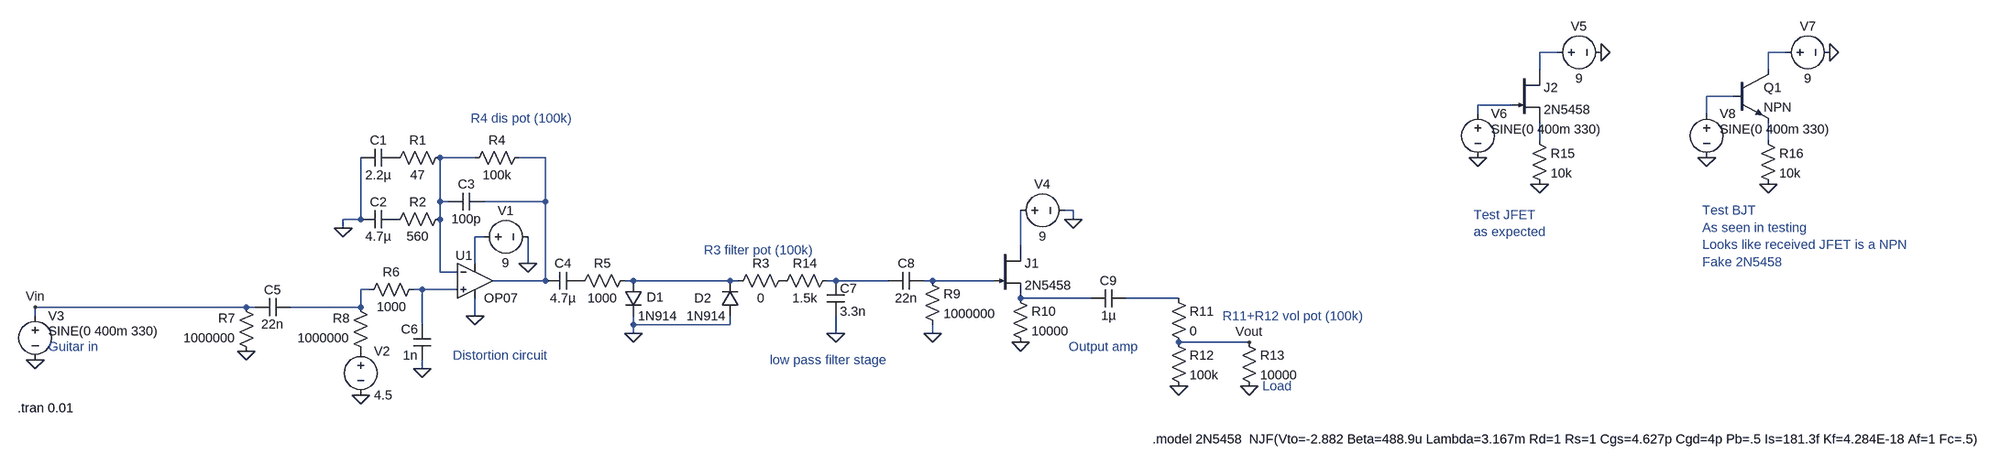
[diagram p0: schematic distortion sim.asc]
distortion sim.asc, the LTspice schematic file:
Version 4
SHEET 1 3272 680
WIRE 2352 -944 2320 -944
WIRE 2768 -944 2736 -944
WIRE 2320 -912 2320 -944
WIRE 2736 -912 2736 -944
WIRE 2672 -864 2624 -864
WIRE 2272 -848 2208 -848
WIRE 2208 -832 2208 -848
WIRE 2624 -832 2624 -864
WIRE 2320 -784 2320 -816
WIRE 2736 -784 2736 -816
WIRE 384 -752 320 -752
WIRE 512 -752 464 -752
WIRE 320 -672 320 -752
WIRE 336 -672 320 -672
WIRE 512 -672 512 -752
WIRE 512 -672 400 -672
WIRE 1472 -656 1456 -656
WIRE 176 -640 176 -752
WIRE 176 -640 144 -640
WIRE 320 -640 320 -672
WIRE 1472 -640 1472 -656
WIRE 144 -624 144 -640
WIRE 400 -608 384 -608
WIRE 1376 -592 1376 -656
WIRE 384 -560 384 -608
WIRE 480 -560 480 -608
WIRE 320 -544 320 -640
WIRE 352 -544 320 -544
WIRE 512 -528 512 -672
WIRE 512 -528 416 -528
WIRE 672 -528 656 -528
WIRE 848 -528 672 -528
WIRE 864 -528 848 -528
WIRE 1040 -528 1024 -528
WIRE 1136 -528 1040 -528
WIRE 1216 -528 1200 -528
WIRE 1328 -528 1216 -528
WIRE 192 -512 176 -512
WIRE 288 -512 272 -512
WIRE 352 -512 288 -512
WIRE 1504 -496 1376 -496
WIRE 1664 -496 1568 -496
WIRE -32 -480 -416 -480
WIRE -16 -480 -32 -480
WIRE 176 -480 176 -512
WIRE 176 -480 48 -480
WIRE -416 -464 -416 -480
WIRE 384 -464 384 -496
WIRE 288 -448 288 -512
WIRE 672 -448 672 -464
WIRE 848 -448 848 -464
WIRE 848 -448 672 -448
WIRE 672 -432 672 -448
WIRE 1040 -432 1040 -464
WIRE 1216 -432 1216 -448
WIRE 1792 -416 1664 -416
WIRE 288 -368 288 -384
FLAG 384 -464 0
FLAG 144 -624 0
FLAG 288 -368 0
FLAG -32 -400 0
FLAG 672 -432 0
FLAG 176 -320 0
FLAG -416 -384 0
FLAG 1040 -432 0
FLAG 1472 -640 0
FLAG 1376 -416 0
FLAG 1216 -432 0
FLAG 1664 -336 0
FLAG 1792 -336 0
FLAG -416 -480 Vin
FLAG 1792 -416 Vout
FLAG 480 -560 0
FLAG 2432 -944 0
FLAG 2320 -704 0
FLAG 2208 -752 0
FLAG 2848 -944 0
FLAG 2736 -704 0
FLAG 2624 -752 0
SYMBOL cap 240 -768 R90
WINDOW 0 0 32 VBottom 2
WINDOW 3 32 32 VTop 2
SYMATTR InstName C1
SYMATTR Value 2.2µ
SYMBOL cap 240 -656 R90
WINDOW 0 0 32 VBottom 2
WINDOW 3 32 32 VTop 2
SYMATTR InstName C2
SYMATTR Value 4.7µ
SYMBOL cap 400 -688 R90
WINDOW 0 0 32 VBottom 2
WINDOW 3 32 32 VTop 2
SYMATTR InstName C3
SYMATTR Value 100p
SYMBOL cap 576 -544 R90
WINDOW 0 0 32 VBottom 2
WINDOW 3 32 32 VTop 2
SYMATTR InstName C4
SYMATTR Value 4.7µ
SYMBOL res 336 -768 R90
WINDOW 0 0 56 VBottom 2
WINDOW 3 32 56 VTop 2
SYMATTR InstName R1
SYMATTR Value 47
SYMBOL res 336 -656 R90
WINDOW 0 0 56 VBottom 2
WINDOW 3 32 56 VTop 2
SYMATTR InstName R2
SYMATTR Value 560
SYMBOL res 480 -768 R90
WINDOW 0 0 56 VBottom 2
WINDOW 3 32 56 VTop 2
SYMATTR InstName R4
SYMATTR Value 100k
SYMBOL res 672 -544 R90
WINDOW 0 0 56 VBottom 2
WINDOW 3 32 56 VTop 2
SYMATTR InstName R5
SYMATTR Value 1000
SYMBOL res 288 -528 R90
WINDOW 0 0 56 VBottom 2
WINDOW 3 32 56 VTop 2
SYMATTR InstName R6
SYMATTR Value 1000
SYMBOL res -16 -384 R180
WINDOW 0 36 76 Left 2
WINDOW 3 36 40 Left 2
SYMATTR InstName R7
SYMATTR Value 1000000
SYMBOL res 192 -384 R180
WINDOW 0 36 76 Left 2
WINDOW 3 36 40 Left 2
SYMATTR InstName R8
SYMATTR Value 1000000
SYMBOL cap 48 -496 R90
WINDOW 0 0 32 VBottom 2
WINDOW 3 32 32 VTop 2
SYMATTR InstName C5
SYMATTR Value 22n
SYMBOL cap 304 -384 R180
WINDOW 0 24 56 Left 2
WINDOW 3 24 8 Left 2
SYMATTR InstName C6
SYMATTR Value 1n
SYMBOL Opamps\\OP07 384 -592 R0
WINDOW 0 -35 18 Left 2
SYMATTR InstName U1
SYMBOL diode 656 -528 R0
WINDOW 0 40 30 Left 2
SYMATTR InstName D1
SYMATTR Value 1N914
SYMBOL diode 864 -464 R180
WINDOW 0 50 32 Left 2
WINDOW 3 24 0 Left 2
SYMATTR InstName D2
SYMATTR Value 1N914
SYMBOL voltage 176 -416 R0
WINDOW 123 0 0 Left 0
WINDOW 39 0 0 Left 0
SYMATTR InstName V2
SYMATTR Value 4.5
SYMBOL voltage -416 -480 R0
WINDOW 3 24 44 Left 2
WINDOW 123 24 44 Left 2
WINDOW 39 0 0 Left 0
SYMATTR Value SINE(0 400m 330)
SYMATTR InstName V3
SYMBOL voltage 384 -608 R270
WINDOW 0 32 56 VTop 2
WINDOW 3 -32 56 VBottom 2
WINDOW 123 0 0 Left 0
WINDOW 39 0 0 Left 0
SYMATTR InstName V1
SYMATTR Value 9
SYMBOL res 960 -544 R90
WINDOW 0 0 56 VBottom 2
WINDOW 3 32 56 VTop 2
SYMATTR InstName R3
SYMATTR Value 0
SYMBOL cap 1024 -528 R0
WINDOW 0 24 14 Left 2
SYMATTR InstName C7
SYMATTR Value 3.3n
SYMBOL res 1200 -544 R0
SYMATTR InstName R9
SYMATTR Value 1000000
SYMBOL njf 1328 -592 R0
SYMATTR InstName J1
SYMATTR Value 2N5458
SYMBOL cap 1200 -544 R90
WINDOW 0 0 32 VBottom 2
WINDOW 3 32 32 VTop 2
SYMATTR InstName C8
SYMATTR Value 22n
SYMBOL res 1360 -512 R0
SYMATTR InstName R10
SYMATTR Value 10000
SYMBOL cap 1568 -512 R90
WINDOW 0 0 32 VBottom 2
WINDOW 3 32 32 VTop 2
SYMATTR InstName C9
SYMATTR Value 1µ
SYMBOL res 1648 -512 R0
SYMATTR InstName R11
SYMATTR Value 0
SYMBOL res 1648 -432 R0
SYMATTR InstName R12
SYMATTR Value 100k
SYMBOL voltage 1360 -656 R270
WINDOW 0 32 56 VTop 2
WINDOW 3 -32 56 VBottom 2
WINDOW 123 0 0 Left 0
WINDOW 39 0 0 Left 0
SYMATTR InstName V4
SYMATTR Value 9
SYMBOL res 1776 -432 R0
SYMATTR InstName R13
SYMATTR Value 10000
SYMBOL res 1040 -544 R90
WINDOW 0 0 56 VBottom 2
WINDOW 3 32 56 VTop 2
SYMATTR InstName R14
SYMATTR Value 1.5k
SYMBOL njf 2272 -912 R0
SYMATTR InstName J2
SYMATTR Value 2N5458
SYMBOL res 2304 -800 R0
SYMATTR InstName R15
SYMATTR Value 10k
SYMBOL voltage 2336 -944 R270
WINDOW 0 32 56 VTop 2
WINDOW 3 -32 56 VBottom 2
WINDOW 123 0 0 Left 0
WINDOW 39 0 0 Left 0
SYMATTR InstName V5
SYMATTR Value 9
SYMBOL voltage 2208 -848 R0
WINDOW 3 24 44 Left 2
WINDOW 123 24 44 Left 2
WINDOW 39 0 0 Left 0
SYMATTR Value SINE(0 400m 330)
SYMATTR InstName V6
SYMBOL res 2720 -800 R0
SYMATTR InstName R16
SYMATTR Value 10k
SYMBOL voltage 2752 -944 R270
WINDOW 0 32 56 VTop 2
WINDOW 3 -32 56 VBottom 2
WINDOW 123 0 0 Left 0
WINDOW 39 0 0 Left 0
SYMATTR InstName V7
SYMATTR Value 9
SYMBOL voltage 2624 -848 R0
WINDOW 3 24 44 Left 2
WINDOW 123 24 44 Left 2
WINDOW 39 0 0 Left 0
SYMATTR Value SINE(0 400m 330)
SYMATTR InstName V8
SYMBOL npn 2672 -912 R0
SYMATTR InstName Q1
TEXT -448 -296 Left 2 !.tran 0.01
TEXT 920 -384 Left 2 ;low pass filter stage
TEXT 1464 -408 Left 2 ;Output amp
TEXT 344 -392 Left 2 ;Distortion circuit
TEXT 376 -824 Left 2 ;R4 dis pot (100k)
TEXT 800 -584 Left 2 ;R3 filter pot (100k)
TEXT 1744 -464 Left 2 ;R11+R12 vol pot (100k)
TEXT -392 -408 Left 2 ;Guitar in
TEXT 1816 -336 Left 2 ;Load
TEXT 1616 -240 Left 2 !.model 2N5458  NJF(Vto=-2.882 Beta=488.9u Lambda=3.167m Rd=1 Rs=1 Cgs=4.627p Cgd=4p Pb=.5 Is=181.3f Kf=4.284E-18 Af=1 Fc=.5)
TEXT 2200 -648 Left 2 ;Test JFET\nas expected
TEXT 2616 -656 Left 2 ;Test BJT\nAs seen in testing\nLooks like received JFET is a NPN\nFake 2N5458

The netlist it stands for:
* distortion sim.asc
C1 P001 0 2.2µ
C2 P002 0 4.7µ
C3 N008 N007 100p
C4 P003 N008 4.7µ
R1 N007 P001 47
R2 N007 P002 560
R4 N008 N007 100k
R5 N011 P003 1000
R6 N015 N014 1000
R7 0 Vin 1000000
R8 P004 N014 1000000
C5 N014 Vin 22n
C6 0 N015 1n
XU1 N015 N007 N009 0 N008 LT1001  ; OP07, pins In+ In- V+ V- OUT
D1 N011 0 1N914
D2 0 N011 1N914
V2 P004 0 4.5
V3 Vin 0 SINE(0 400m 330)
V1 N009 0 9
R3 P005 N011 0
C7 N012 0 3.3n
R9 N013 0 1000000
J1 N010 N013 N016 2N5458
C8 N013 N012 22n
R10 N016 0 10000
C9 N017 N016 1µ
R11 N017 Vout 0
R12 Vout 0 100k
V4 N010 0 9
R13 Vout 0 10000
R14 N012 P005 1.5k
J2 N001 N004 N005 2N5458
R15 N005 0 10k
V5 N001 0 9
V6 N004 0 SINE(0 400m 330)
R16 N006 0 10k
V7 N002 0 9
V8 N003 0 SINE(0 400m 330)
Q1 N002 N003 N006 0 NPN
.model D D
.lib standard.dio
.model NPN NPN
.model PNP PNP
.lib standard.bjt
.model NJF NJF
.model PJF PJF
.lib standard.jft
.tran 0.01
* low pass filter stage
* Output amp
* Distortion circuit
* R4 dis pot (100k)
* R3 filter pot (100k)
* R11+R12 vol pot (100k)
* Guitar in
* Load
.model 2N5458  NJF(Vto=-2.882 Beta=488.9u Lambda=3.167m Rd=1 Rs=1 Cgs=4.627p Cgd=4p Pb=.5 Is=181.3f Kf=4.284E-18 Af=1 Fc=.5)
* Test JFET
* as expected
* Test BJT
* As seen in testing
* Looks like received JFET is a NPN
* Fake 2N5458
.lib LTC.lib
.backanno
.end